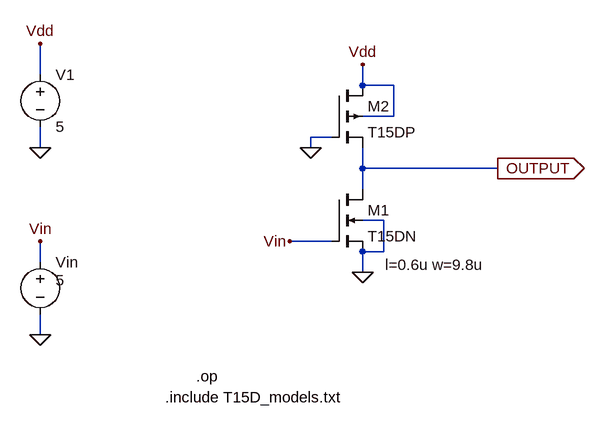
[diagram p0: schematic Draft1.asc]
Draft1.asc, the LTspice schematic file:
Version 4
SHEET 1 924 680
WIRE -144 -272 -144 -320
WIRE 352 -256 352 -288
WIRE 400 -256 352 -256
WIRE 400 -208 400 -256
WIRE 400 -208 352 -208
WIRE 304 -176 272 -176
WIRE -144 -160 -144 -192
WIRE 272 -160 272 -176
WIRE 352 -128 352 -160
WIRE 560 -128 352 -128
WIRE 352 -96 352 -128
WIRE 384 -48 352 -48
WIRE 304 -16 240 -16
WIRE 384 0 384 -48
WIRE 384 0 352 0
WIRE -144 16 -144 -16
WIRE 352 32 352 0
WIRE -144 128 -144 96
FLAG 352 32 0
FLAG -144 -160 0
FLAG -144 -320 Vdd
FLAG 352 -288 Vdd
FLAG 272 -160 0
FLAG -144 128 0
FLAG 240 -16 Vin
FLAG -144 -16 Vin
FLAG 560 -128 OUTPUT
IOPIN 560 -128 Out
SYMBOL nmos4 304 -96 R0
WINDOW 123 83 116 Left 2
SYMATTR Value2 l=0.6u w=9.8u
SYMATTR InstName M1
SYMATTR Value T15DN
SYMBOL pmos4 304 -256 R0
SYMATTR InstName M2
SYMATTR Value T15DP
SYMATTR Value2 l=0.6u w=3.2u
SYMBOL voltage -144 -288 R0
WINDOW 123 0 0 Left 2
WINDOW 39 0 0 Left 2
SYMATTR InstName V1
SYMATTR Value 5
SYMBOL voltage -144 0 R0
WINDOW 3 24 44 Left 2
WINDOW 123 0 0 Left 2
WINDOW 39 0 0 Left 2
SYMATTR Value 5
SYMATTR InstName Vin
TEXT 48 224 Left 2 !.include T15D_models.txt
TEXT 96 192 Left 2 !.op

The netlist it stands for:
* Draft1.asc
M1 OUTPUT Vin 0 0 T15DN l=0.6u w=9.8u
M2 Vdd 0 OUTPUT Vdd T15DP l=0.6u w=3.2u
V1 Vdd 0 5
Vin Vin 0 5
.model NMOS NMOS
.model PMOS PMOS
.lib standard.mos
.include T15D_models.txt
.op
.backanno
.end